# EasyEDA Pro project ProPrj_Inverted_MAML_6x6_2026-09-04.epro, schematic SIGMOID_CELL
Create Date: 2026-06-14; Page Name: P1; Project Name: Inverted_MAML_6x6; Schematic Name: Schematic1; Update Date: 2026-06-14; Company: EasyEDA.com; Page Size: A4; Version: V1.0
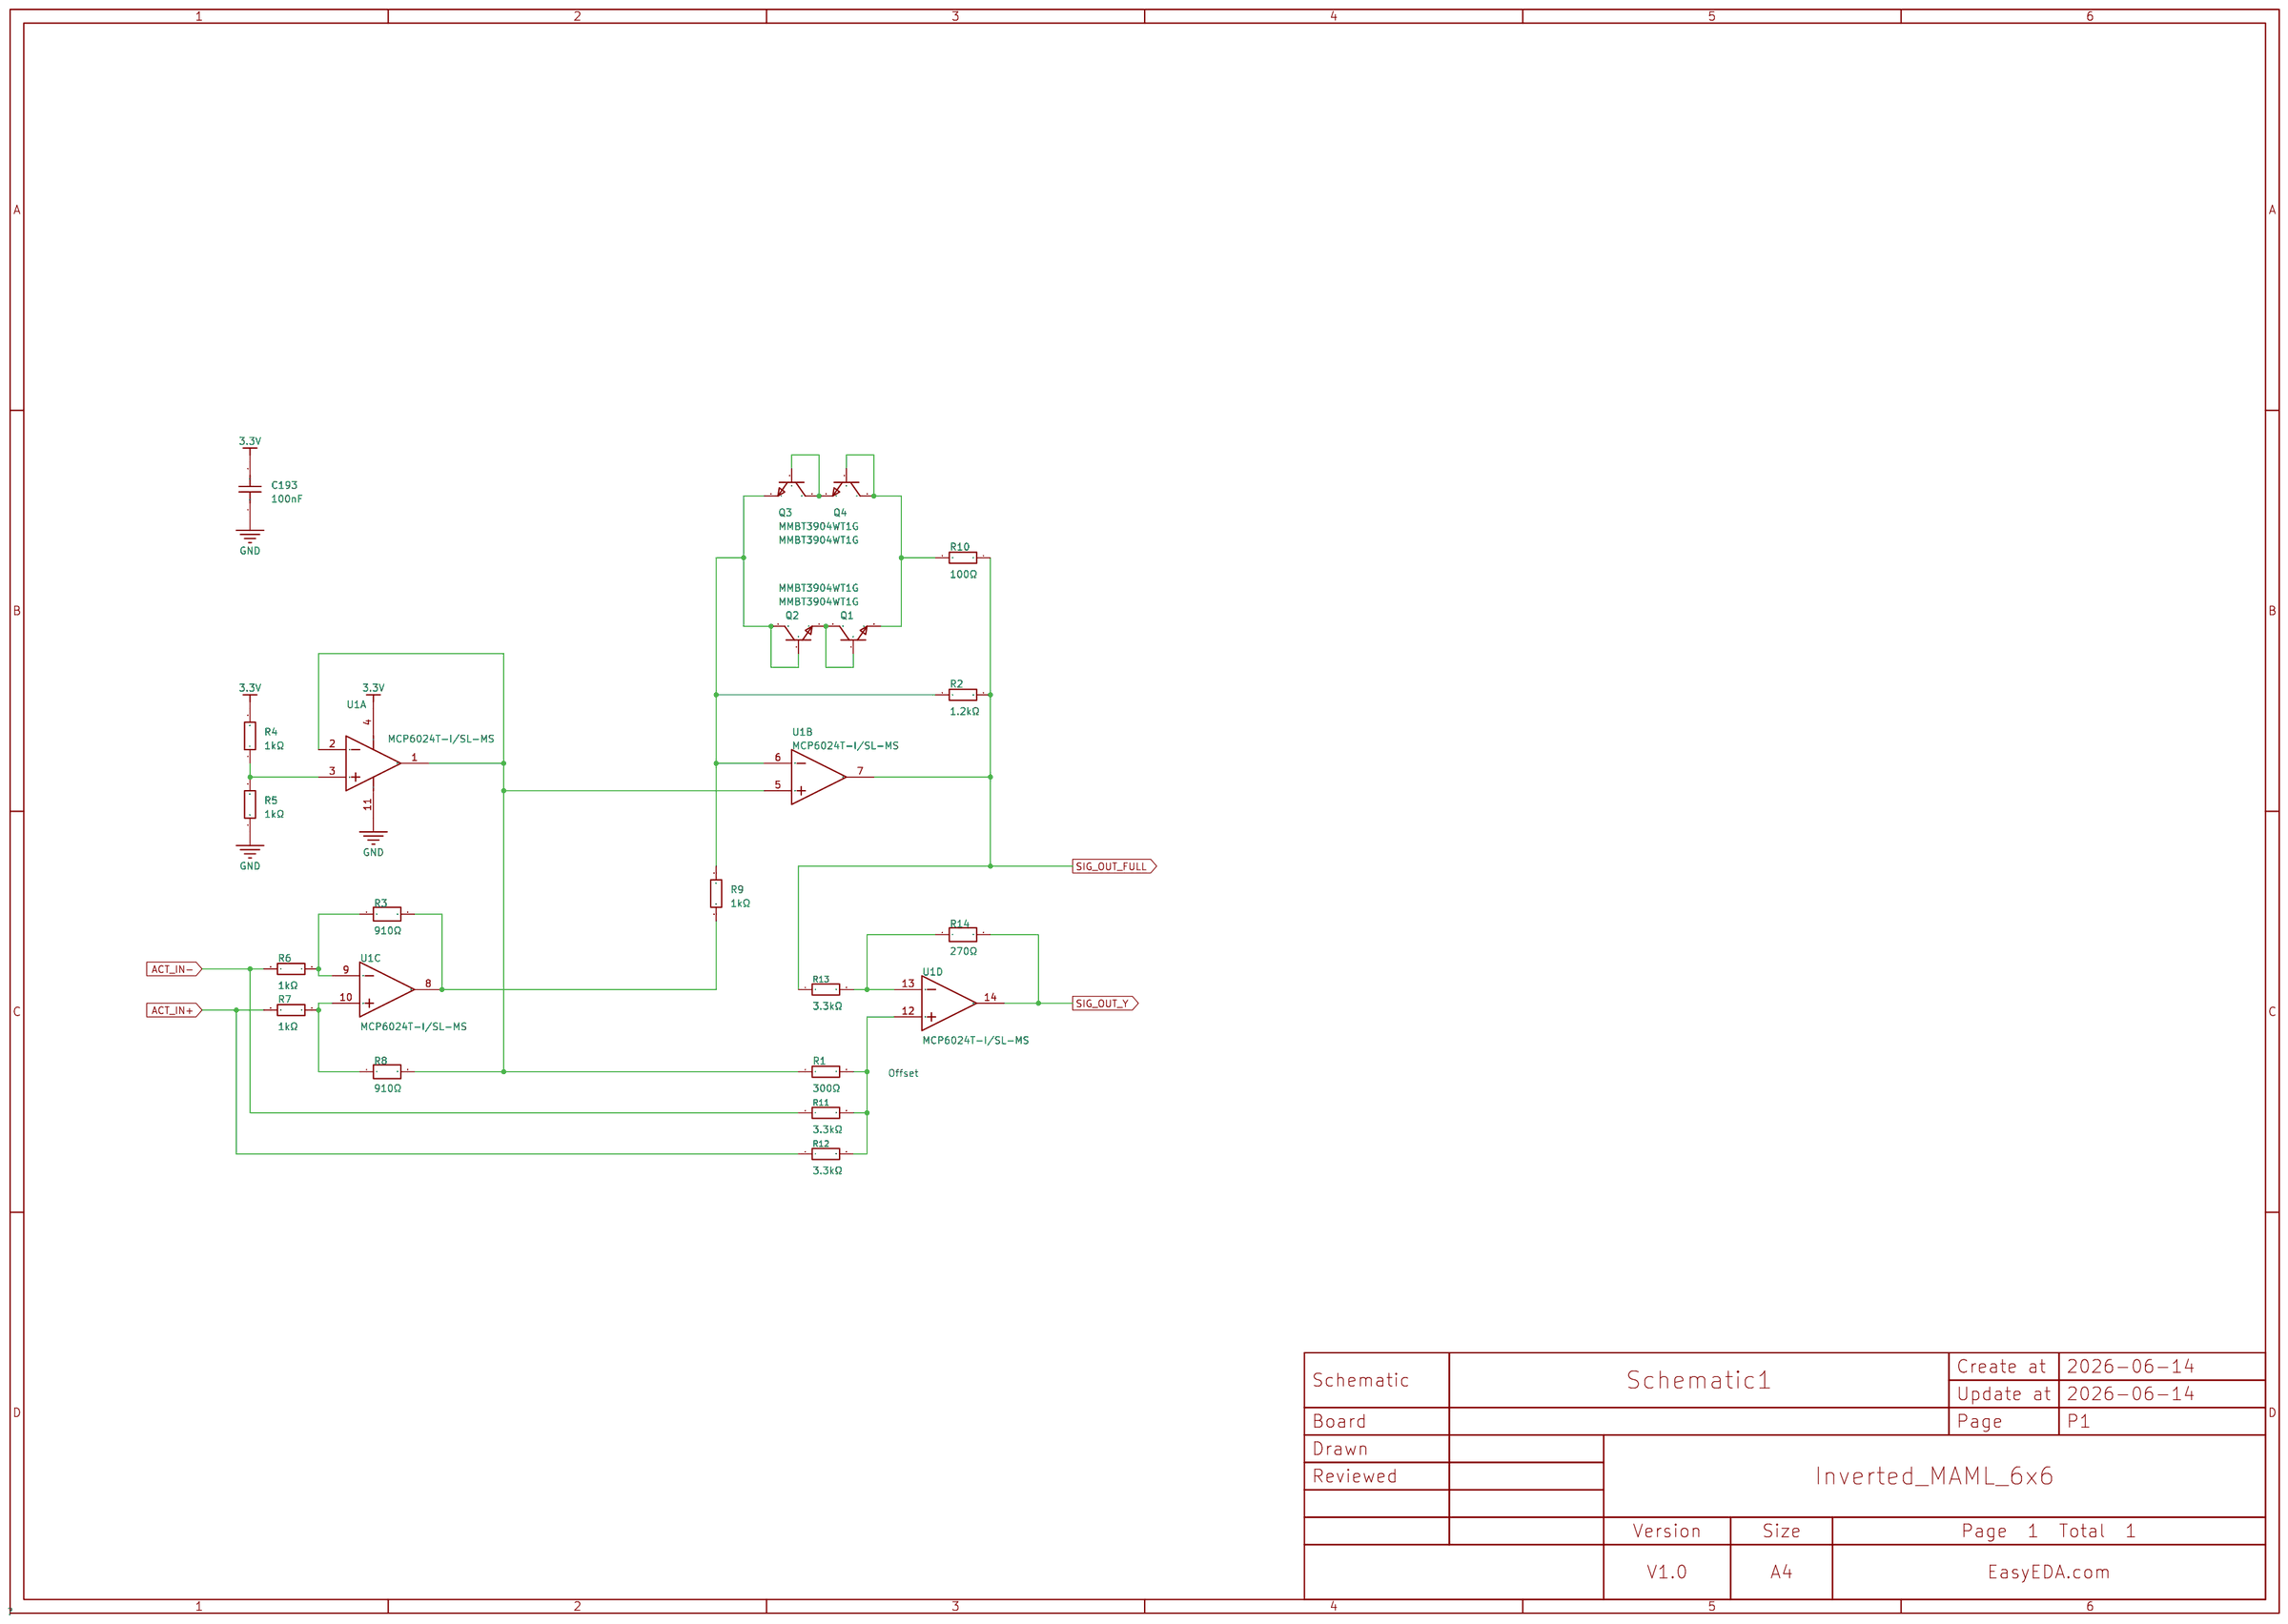
[diagram p7: schematic sheet]

## Parts
C193  100nF  [C0402]
Q1  MMBT3904WT1G  [SC-70-3_L2.1-W1.3-P1.30-LS2.1-BR]
Q2  MMBT3904WT1G  [SC-70-3_L2.1-W1.3-P1.30-LS2.1-BR]
Q3  MMBT3904WT1G  [SC-70-3_L2.1-W1.3-P1.30-LS2.1-BR]
Q4  MMBT3904WT1G  [SC-70-3_L2.1-W1.3-P1.30-LS2.1-BR]
R1  300Ω  [R0402]
R2  1.2kΩ  [R0402]
R3  910Ω  [R0402]
R4  1kΩ  [R0402]
R5  1kΩ  [R0402]
R6  1kΩ  [R0402]
R7  1kΩ  [R0402]
R8  910Ω  [R0402]
R9  1kΩ  [R0402]
R10  100Ω  [R0402]
R11  3.3kΩ  [R0402]
R12  3.3kΩ  [R0402]
R13  3.3kΩ  [R0402]
R14  270Ω  [R0402]
U1  MCP6024T-I/SL-MS  [SOIC-14_L8.7-W3.9-P1.27-LS6.0-BL-1]  (sections 1,2,3,4)

## Library data of the parts
C193 = CL05B104KO5NNNC: Capacitance:100nF Tolerance:±10% Tolerance:±10% Voltage Rating:16V Temperature Coefficient:X7R; LCSC Part Name: 100nF ±10% 16V; Supplier Part: C1525; Manufacturer: SAMSUNG(三星); Supplier Footprint: 0402; JLCPCB Part Class: Basic Part; Datasheet: https://item.szlcsc.com/datasheet/CL05B104KO5NNNC/1877.html; Supplier: LCSC; Tolerance: ±10%; Voltage Rating: 16V; Temperature Coefficient: X7R
Q1-Q4 = MMBT3904WT1G: type:NPN Current - Collector(Ic):200mA Collector - Emitter Voltage VCEO:40V Pd - Power Dissipation:150mW DC Current Gain:40@0.1mA,1.0V DC Current Gain:40@0.1mA,1.0V Transition frequency(fT):300MHz Current - Collector Cutoff:50nA Vce Saturation(VCE(sat)):2; LCSC Part Name: NPN 电流:200mA 电压:40V; Supplier Part: C58011; Manufacturer: onsemi(安森美); Supplier Footprint: SC-70(SOT-323); JLCPCB Part Class: Extended Part; Datasheet: https://item.szlcsc.com/datasheet/MMBT3904WT1G/59048.html; Supplier: LCSC; type: NPN; Current - Collector(Ic): 200mA; Collector - Emitter Voltage VCEO: 40V; Pd - Power Dissipation: 150mW; DC Current Gain: 40@0.1mA,1.0V; Transition frequency(fT): 300MHz; Current - Collector Cutoff: 50nA; Vce Saturation(VCE(sat)): 200mV; Operating Temperature: -55℃~+150℃; Emitter-Base Voltage(Vebo): 6V
R1 = 0402WGF3000TCE: Type:Thick Film Resistors Resistance: Tolerance:±1% Tolerance:±1% Power(Watts): Overload Voltage (Max): Temperature Coefficient:±100ppm/℃ Temperature Coefficient:±100ppm/℃ Operating Temperature Range:-55℃~+155℃ Operating Temperature Range:-55℃~+155℃; LCSC Part Name: 300Ω ±1% 62.5mW 厚膜电阻; Supplier Part: C25102; Manufacturer: UNI-ROYAL(厚声); Supplier Footprint: 0402; JLCPCB Part Class: Extended Part; Datasheet: https://atta.szlcsc.com/upload/public/pdf/source/20200306/C422600_1E6D84923E4A46A82E41ADD87F860B5C.pdf; Supplier: LCSC; Type: Thick Film Resistors; Tolerance: ±1%; Temperature Coefficient: ±100ppm/℃; Operating Temperature Range: -55℃~+155℃
R2 = 0402WGF1201TCE: Type:Thick Film Resistor Resistance:1.2kΩ Tolerance:±1% Tolerance:±1% Power(Watts):62.5mW Voltage-Supply(Max):50V Temperature Coefficient:±100ppm/℃ Temperature Coefficient:±100ppm/℃ Operating Temperature:-55℃~+155℃ Operating Temperature:-55℃~+155℃; LCSC Part Name: 1.2kΩ ±1% 62.5mW 厚膜电阻; Supplier Part: C25862; Manufacturer: UNI-ROYAL(厚声); Supplier Footprint: 0402; JLCPCB Part Class: Extended Part; Datasheet: https://item.szlcsc.com/datasheet/0402WGF1201TCE/26605.html; Supplier: LCSC; Type: Thick Film Resistor; Tolerance: ±1%; Power(Watts): 62.5mW; Voltage-Supply(Max): 50V; Temperature Coefficient: ±100ppm/℃; Operating Temperature: -55℃~+155℃
R3 R8 = SCR0402J910R: Type:Thick Film Resistor Resistance:910Ω Tolerance:±5% Tolerance:±5% Power(Watts):62.5mW Voltage-Supply(Max):50V Temperature Coefficient:±200ppm/℃ Temperature Coefficient:±200ppm/℃ Operating Temperature:-55℃~+155℃ Operating Temperature:-55℃~+155℃; LCSC Part Name: 厚膜电阻 910Ω ±5% 62.5mW; Supplier Part: C3017583; Manufacturer: VO(翔胜); Supplier Footprint: 0402; JLCPCB Part Class: Extended Part; Datasheet: https://item.szlcsc.com/datasheet/SCR0402J910R/3530107.html; Supplier: LCSC; Type: Thick Film Resistor; Tolerance: ±5%; Power(Watts): 62.5mW; Voltage-Supply(Max): 50V; Temperature Coefficient: ±200ppm/℃; Operating Temperature: -55℃~+155℃
R4-R7 R9 = 0402WGF1001TCE: Type:Thick Film Resistor Resistance:1kΩ Tolerance:±1% Tolerance:±1% Power(Watts):62.5mW Voltage-Supply(Max):50V Temperature Coefficient:±100ppm/℃ Temperature Coefficient:±100ppm/℃ Operating Temperature:-55℃~+155℃ Operating Temperature:-55℃~+155℃; LCSC Part Name: 1kΩ ±1% 62.5mW 厚膜电阻; Supplier Part: C11702; Manufacturer: UNI-ROYAL(厚声); Supplier Footprint: 0402; JLCPCB Part Class: Basic Part; Datasheet: https://item.szlcsc.com/datasheet/0402WGF1001TCE/12256.html; Supplier: LCSC; Type: Thick Film Resistor; Tolerance: ±1%; Power(Watts): 62.5mW; Voltage-Supply(Max): 50V; Temperature Coefficient: ±100ppm/℃; Operating Temperature: -55℃~+155℃
R10 = 0402WGF1000TCE: Type:Thick Film Resistors Resistance: Tolerance:±1% Tolerance:±1% Power(Watts): Overload Voltage (Max): Temperature Coefficient:±200ppm/℃ Temperature Coefficient:±200ppm/℃ Operating Temperature Range:-55℃~+155℃ Operating Temperature Range:-55℃~+155℃; LCSC Part Name: 100Ω ±1% 62.5mW 厚膜电阻; Supplier Part: C25076; Manufacturer: UNI-ROYAL(厚声); Supplier Footprint: 0402; JLCPCB Part Class: Basic Part; Datasheet: https://atta.szlcsc.com/upload/public/pdf/source/20200306/C422600_1E6D84923E4A46A82E41ADD87F860B5C.pdf; Supplier: LCSC; Type: Thick Film Resistors; Tolerance: ±1%; Temperature Coefficient: ±200ppm/℃; Operating Temperature Range: -55℃~+155℃
R11-R13 = 0402WGF3301TCE: Type:Thick Film Resistor Resistance:3.3kΩ Tolerance:±1% Tolerance:±1% Power(Watts):62.5mW Voltage-Supply(Max):50V Temperature Coefficient:±100ppm/℃ Temperature Coefficient:±100ppm/℃ Operating Temperature:-55℃~+155℃ Operating Temperature:-55℃~+155℃; LCSC Part Name: 3.3kΩ ±1% 62.5mW 厚膜电阻; Supplier Part: C25890; Manufacturer: UNI-ROYAL(厚声); Supplier Footprint: 0402; JLCPCB Part Class: Basic Part; Datasheet: https://item.szlcsc.com/datasheet/0402WGF3301TCE/26633.html; Supplier: LCSC; Type: Thick Film Resistor; Tolerance: ±1%; Power(Watts): 62.5mW; Voltage-Supply(Max): 50V; Temperature Coefficient: ±100ppm/℃; Operating Temperature: -55℃~+155℃
R14 = CRCW0402270RFKED: Type:Thick Film Resistors Resistance: Tolerance:±1% Tolerance:±1% Power(Watts): Overload Voltage (Max): Temperature Coefficient:±100ppm/℃ Temperature Coefficient:±100ppm/℃ Operating Temperature Range:-55℃~+155℃ Operating Temperature Range:-55℃~+155℃; LCSC Part Name: 厚膜电阻 270Ω ±1% 62.5mW; Supplier Part: C482120; Manufacturer: VISHAY(威世); Supplier Footprint: 0402; JLCPCB Part Class: Extended Part; Datasheet: https://atta.szlcsc.com/upload/public/pdf/source/20200618/C481956_E25174B008CE8C884BEDD7D4D15E674F.pdf; Supplier: LCSC; Type: Thick Film Resistors; Tolerance: ±1%; Temperature Coefficient: ±100ppm/℃; Operating Temperature Range: -55℃~+155℃
U1 = MCP6024T-I/SL-MS: Supplier Part: C54539958; Manufacturer: MSKSEMI(美森科); Supplier Footprint: SOP-14; JLCPCB Part Class: Extended Part; Datasheet: https://item.szlcsc.com/datasheet/MCP6024T-I%252FSL-MS/57895720.html; Supplier: LCSC

## Nets
3.3V: C193.2 R4.2 U1.4(V+)
GND: C193.1 R5.1 U1.11(V-)
ACT_IN+: R7.2 R12.1
ACT_IN-: R6.2 R11.1
SIG_OUT_FULL: R2.2 R10.1 R13.1 U1.7(OUT2)
SIG_OUT_Y: R14.2 U1.14(OUT4)
Net-(Q1-1): Q1.1(B) Q1.3(C) Q2.2(E)
Net-(Q1-2): Q1.2(E) Q4.1(B) Q4.3(C) R10.2
Net-(Q2-1): Q2.1(B) Q2.3(C) Q3.2(E) R2.1 R9.1 U1.6(IN2-)
Net-(Q3-1): Q3.1(B) Q3.3(C) Q4.2(E)
Net-(R1-1): R1.1 R8.2 U1.1(OUT1) U1.2(IN1-) U1.5(IN2+)
Net-(R1-2): R1.2 R11.2 R12.2 U1.12(IN4+)
Net-(R3-1): R3.1 R6.1 U1.9(IN3-)
Net-(R3-2): R3.2 R9.2 U1.8(OUT3)
Net-(R4-1): R4.1 R5.2 U1.3(IN1+)
Net-(R7-1): R7.1 R8.1 U1.10(IN3+)
Net-(R13-2): R13.2 R14.1 U1.13(IN4-)

## Notes on the sheet
- Offset
